# EAGLE design platform_driver_all2 (EAGLE 6.5.0)
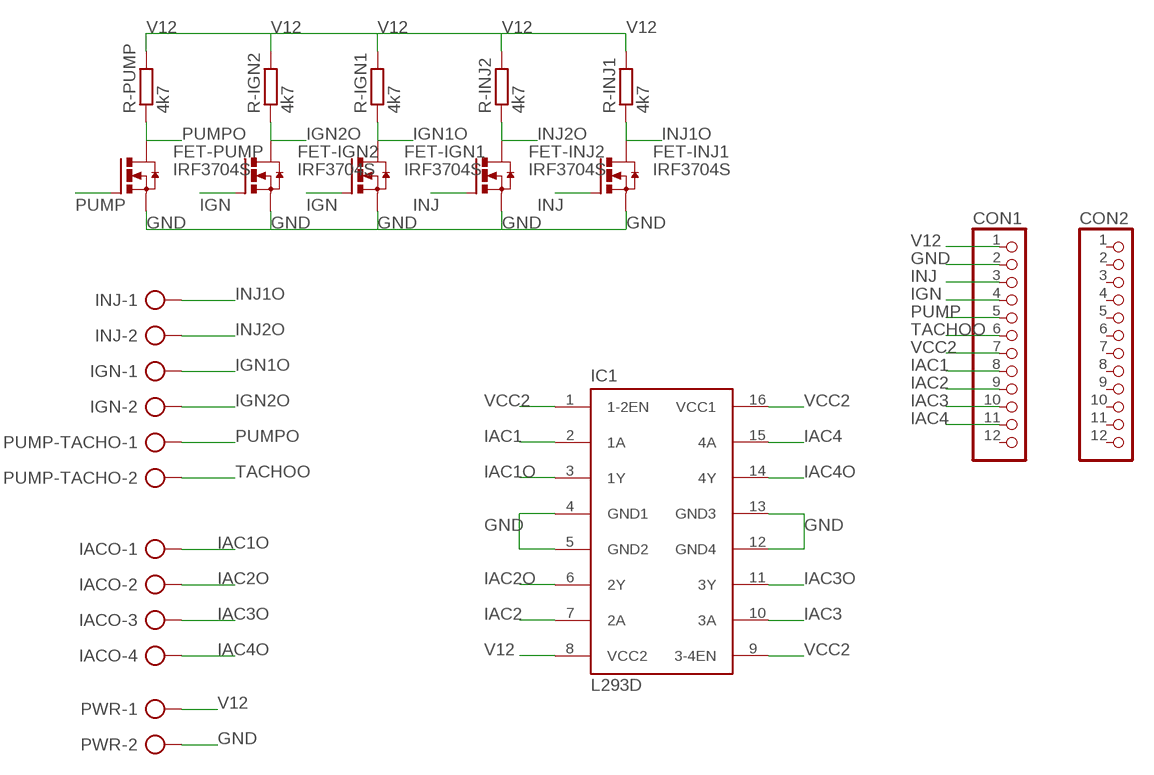
[diagram p0: schematic, sheet 1]

## Parts
CON1  PINHD-1X12  [1X12]
CON2  PINHD-1X12  [1X12]
FET-IGN1  IRF3704S  [D2PACK]
FET-IGN2  IRF3704S  [D2PACK]
FET-INJ1  IRF3704S  [D2PACK]
FET-INJ2  IRF3704S  [D2PACK]
FET-PUMP  IRF3704S  [D2PACK]
IACO  AK300/4  [AK300/4]
IC1  L293D  [DIL16]
IGN  AK300/2  [AK300/2]
INJ  AK300/2  [AK300/2]
PUMP-TACHO  AK300/2  [AK300/2]
PWR  AK300/2  [AK300/2]
R-IGN1  4k7  R-EU_M1206  [M1206]
R-IGN2  4k7  R-EU_M1206  [M1206]
R-INJ1  4k7  R-EU_M1206  [M1206]
R-INJ2  4k7  R-EU_M1206  [M1206]
R-PUMP  4k7  R-EU_M1206  [M1206]

## Nets
GND: CON1.2 FET-IGN1.3(S) FET-IGN2.3(S) FET-INJ1.3(S) FET-INJ2.3(S) FET-PUMP.3(S) IC1.4(GND1) IC1.5(GND2) IC1.12(GND4) IC1.13(GND3) PWR.2
IAC1: CON1.8 IC1.2(1A)
IAC1O: IACO.1 IC1.3(1Y)
IAC2: CON1.9 IC1.7(2A)
IAC2O: IACO.2 IC1.6(2Y)
IAC3: CON1.10 IC1.10(3A)
IAC3O: IACO.3 IC1.11(3Y)
IAC4: CON1.11 IC1.15(4A)
IAC4O: IACO.4 IC1.14(4Y)
IGN: CON1.4 FET-IGN1.1(G) FET-IGN2.1(G)
IGN1O: FET-IGN1.2(D) IGN.1 R-IGN1.1
IGN2O: FET-IGN2.2(D) IGN.2 R-IGN2.1
INJ: CON1.3 FET-INJ1.1(G) FET-INJ2.1(G)
INJ1O: FET-INJ1.2(D) INJ.1 R-INJ1.1
INJ2O: FET-INJ2.2(D) INJ.2 R-INJ2.1
PUMP: CON1.5 FET-PUMP.1(G)
PUMPO: FET-PUMP.2(D) PUMP-TACHO.1 R-PUMP.1
TACHOO: CON1.6 PUMP-TACHO.2
V12: CON1.1 IC1.8(VCC2) PWR.1 R-IGN1.2 R-IGN2.2 R-INJ1.2 R-INJ2.2 R-PUMP.2
VCC2: CON1.7 IC1.1(1-2EN) IC1.9(3-4EN) IC1.16(VCC1)
Unconnected: CON1.12 CON2.1 CON2.2 CON2.3 CON2.4 CON2.5 CON2.6 CON2.7 CON2.8 CON2.9 CON2.10 CON2.11 CON2.12

## Library data of the parts
CON1 CON2 = pinhead:PINHD-1X12: PIN HEADER
FET-IGN1 FET-IGN2 FET-INJ1 FET-INJ2 FET-PUMP = transistor-power:IRF3704: SMPS MOSFET HEXFET® Power MOSFET Source: http://www.irf.com/product-info/datasheets/data/irf3704.pdf
IACO = con-ptr500:AK300/4: CONNECTOR; OC_FARNELL: unknown; OC_NEWARK: unknown
IC1 = st-microelectronics:L293D: PUSH-PULL 4 CHANNEL DRIVER; MPN: L293D; OC_FARNELL: 9589619; OC_NEWARK: 56P8249
IGN INJ PUMP-TACHO PWR = con-ptr500:AK300/2: CONNECTOR; OC_FARNELL: unknown; OC_NEWARK: unknown
R-IGN1 R-IGN2 R-INJ1 R-INJ2 R-PUMP = resistor:R-EU_: RESISTOR, European symbol

## Board
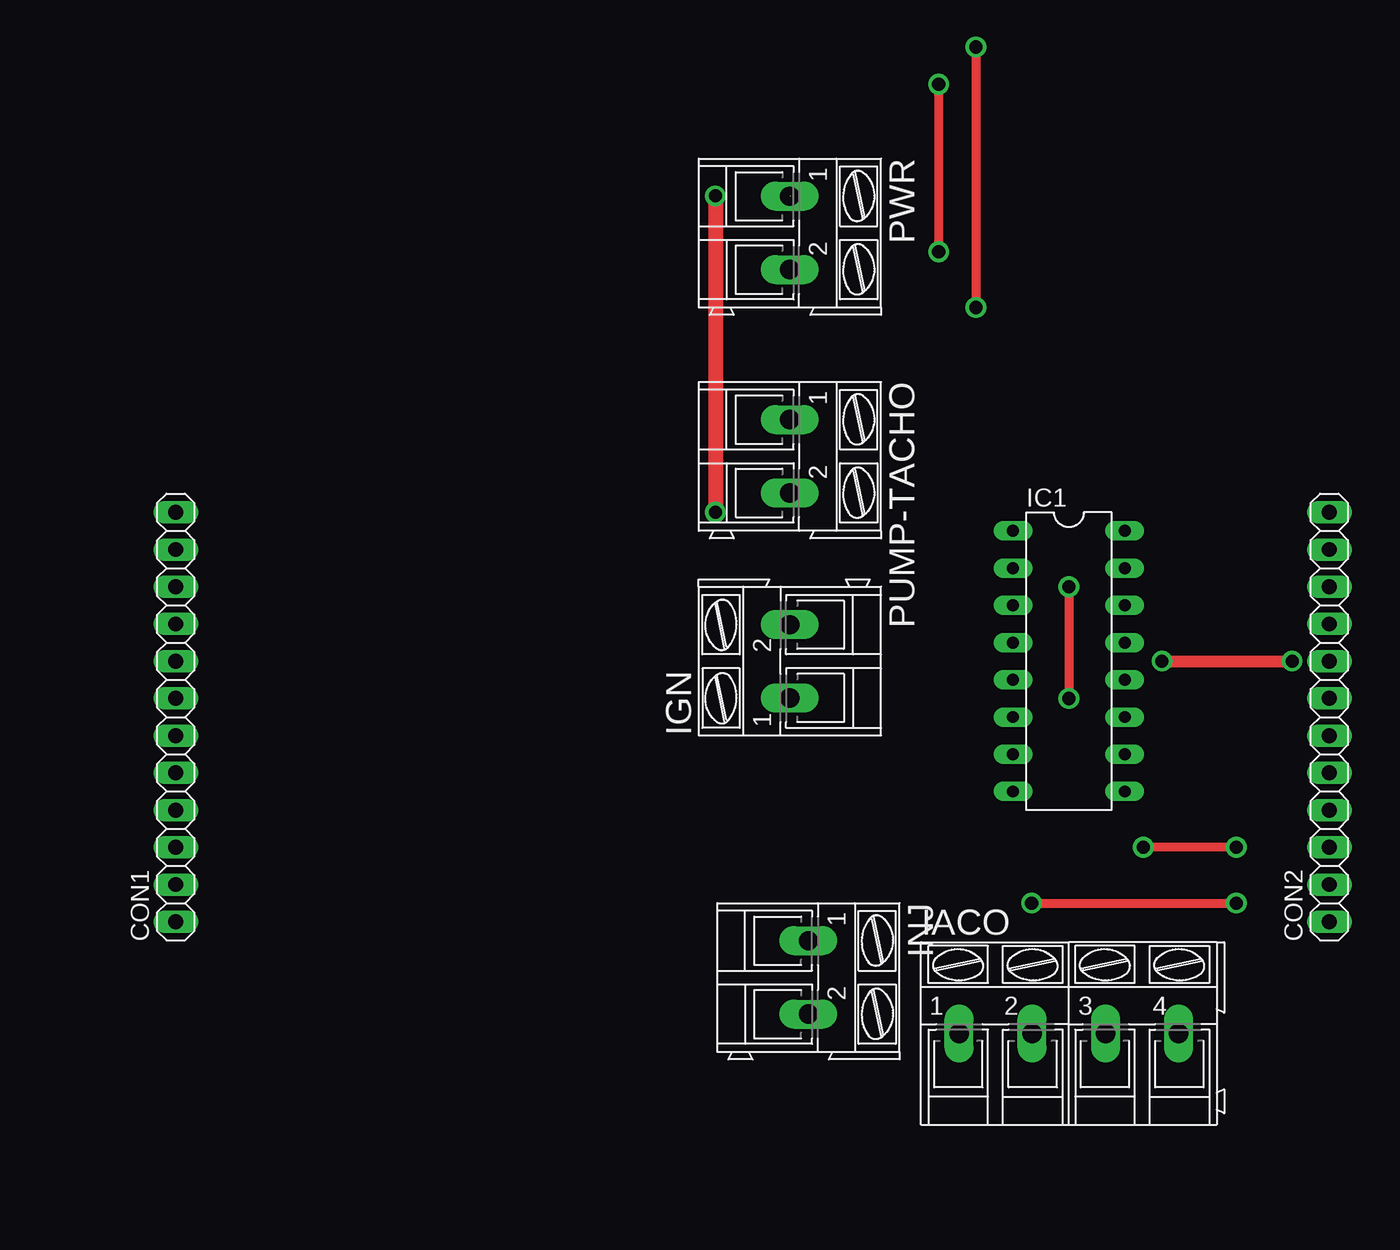
[diagram p1: board, top side]
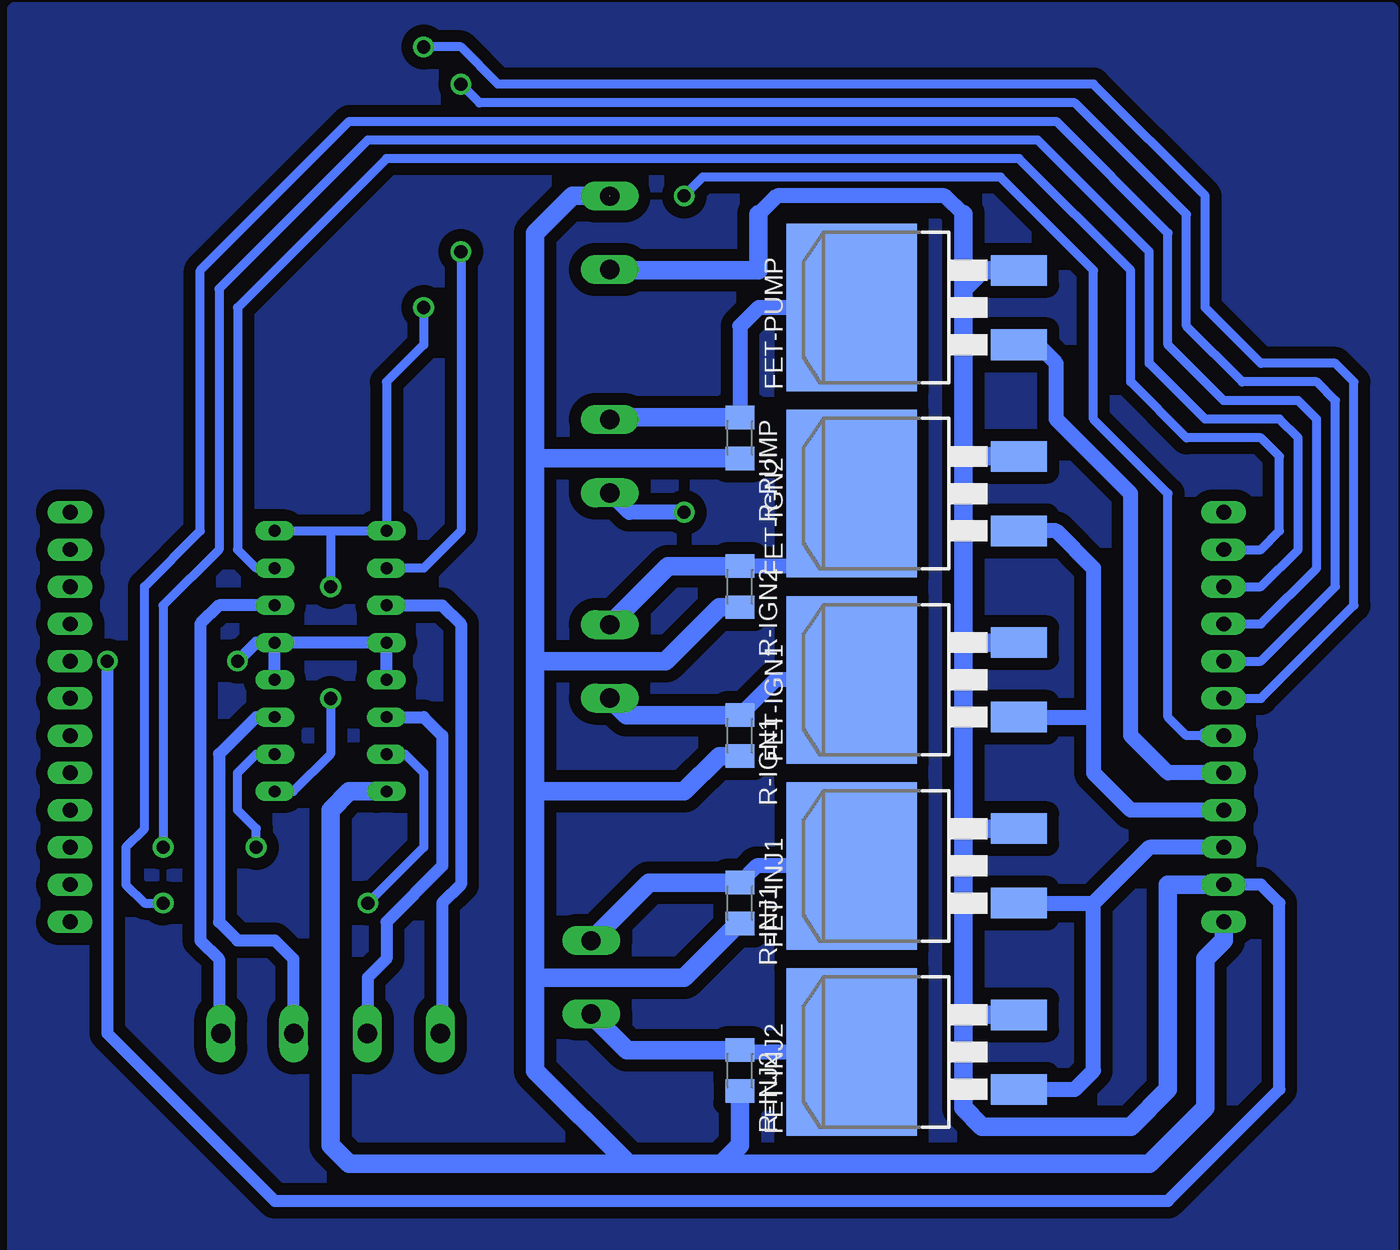
[diagram p2: board, bottom side, seen from below]

No outline drawn. Coordinates in mm, seen from the top.
Copper layers (1*16): Top 0.035mm / dielectric 1.5mm / Bottom 0.035mm
Design rules "default *": minimum track width 10mil, minimum drill 24mil, track to track 8mil, track to pad 8mil, pad to pad 8mil, via to via 8mil, smd to smd 8mil, copper to edge 40mil, drill to drill 8mil, minimum pad ring 10mil, minimum via ring 10mil, stop-mask expansion 4mil, vias tented up to drill 0mil, thermal gap 10mil

### Footprints (pad centres in the part's own frame; a part is rotated, then mirrored left to right if it is on the bottom)
1X12 = drill 1.016 long: 1 -13.97,0; 2 -11.43,0; 3 -8.89,0; 4 -6.35,0; 5 -3.81,0; 6 -1.27,0; 7 1.27,0; 8 3.81,0; 9 6.35,0; 10 8.89,0; 11 11.43,0; 12 13.97,0
D2PACK = smd 2.083 x 3.81: 1 -2.54,-8.89; 3 2.54,-8.89 | smd 11.43 x 8.89: 2 0,2.54
AK300/4 = drill 1.321 long: 1 -7.493,0; 2 -2.515,0; 3 2.515,0; 4 7.493,0
DIL16 = drill 0.813 long: 1 -8.89,-3.81; 2 -6.35,-3.81; 3 -3.81,-3.81; 4 -1.27,-3.81; 5 1.27,-3.81; 6 3.81,-3.81; 7 6.35,-3.81; 8 8.89,-3.81; 9 8.89,3.81; 10 6.35,3.81; 11 3.81,3.81; 12 1.27,3.81; 13 -1.27,3.81; 14 -3.81,3.81; 15 -6.35,3.81; 16 -8.89,3.81
AK300/2 = drill 1.321 long: 1 -2.515,0; 2 2.489,0
M1206 = smd 1.6 x 2: 1 -1.4,0; 2 1.4,0

### Placement (x,y rotation side)
CON1  8.89,34.29 90 top
CON2  87.63,34.29 90 top
FET-IGN1  31.75,36.83 90 bottom
FET-IGN2  31.75,49.53 90 bottom
FET-INJ1  31.75,24.13 90 bottom
FET-INJ2  31.75,11.43 90 bottom
FET-PUMP  31.75,62.23 90 bottom
IACO  69.85,12.7 0 top
IC1  69.85,38.1 270 top
IGN  50.8,38.1 90 top
INJ  52.07,16.51 270 top
PUMP-TACHO  50.8,52.07 270 top
PWR  50.8,67.31 270 top
R-IGN1  41.91,33.02 270 bottom
R-IGN2  41.91,43.18 270 bottom
R-INJ1  41.91,21.59 270 bottom
R-INJ2  41.91,10.16 270 bottom
R-PUMP  41.91,53.34 270 bottom

### Tracks (layer width: path | path; a pad name or v marks a point on that pad's centre or on a via)
GND  (via drill 0.9)
  Top 0.813: v76.2,38.1 v85.09,38.1
  Bottom 0.813: IC1.4 IC1.13 IC1.12 | IC1.5 IC1.4 | IC1.4 74.93,39.37 v76.2,38.1 | v85.09,38.1 85.09,12.7 73.66,1.27 12.7,1.27 5.08,8.89 5.08,21.59 6.35,22.86 CON1.2
  Bottom 1.016: 26.67,68.58 27.94,69.85 39.37,69.85 40.64,68.58
  Bottom 1.27: CON1.2 12.7,22.86 12.7,8.89 15.24,6.35 25.4,6.35 26.67,7.62 26.67,13.97 | 26.67,13.97 26.67,26.67 | 26.67,26.67 26.67,39.37 | 26.67,39.37 26.67,52.07 | 26.67,52.07 26.67,63.5 | 26.67,63.5 25.4,64.77 FET-PUMP.3 | FET-IGN2.3 26.67,52.07 | FET-IGN1.3 26.67,39.37 | FET-INJ1.3 26.67,26.67 | FET-INJ2.3 26.67,13.97 | 26.67,63.5 26.67,68.58 | 40.64,68.58 40.64,64.77 50.75,64.77 PWR.2
IAC1  (via drill 0.9)
  Top 0.61: v60.96,77.47 v60.96,66.04
  Bottom 0.61: CON1.8 6.35,38.1 1.27,43.18 1.27,55.88 2.54,57.15 7.62,57.15 11.43,60.96 11.43,68.58 19.05,76.2 59.69,76.2 v60.96,77.47 | v60.96,66.04 60.96,46.99 63.5,44.45 IC1.2
IAC1O
  Bottom 0.813: IC1.3 62.23,41.91 60.96,40.64 60.96,22.86 62.23,21.59 62.23,12.83 IACO.1
IAC2  (via drill 0.9)
  Top 0.61: v67.31,21.59 v81.28,21.59
  Bottom 0.61: CON1.9 6.35,40.64 2.54,44.45 2.54,54.61 3.81,55.88 8.89,55.88 12.7,59.69 12.7,67.31 20.32,74.93 68.58,74.93 78.74,64.77 78.74,46.99 82.55,43.18 82.55,26.67 83.82,25.4 83.82,22.86 82.55,21.59 v81.28,21.59 | IC1.7 64.77,31.75 63.5,30.48 63.5,25.4 v67.31,21.59
IAC2O
  Bottom 0.813: IC1.6 63.5,34.29 62.23,33.02 62.23,24.13 66.04,20.32 66.04,17.78 67.31,16.51 67.31,12.72 IACO.2
IAC3  (via drill 0.9)
  Top 0.61: v81.28,25.4 v74.93,25.4
  Bottom 0.61: CON1.10 6.35,43.18 3.81,45.72 3.81,53.34 5.08,54.61 10.16,54.61 13.97,58.42 13.97,66.04 21.59,73.66 67.31,73.66 77.47,63.5 77.47,45.72 81.28,41.91 v81.28,25.4 | v74.93,25.4 74.93,26.67 76.2,27.94 76.2,30.48 74.93,31.75 IC1.10
IAC3O
  Bottom 0.813: IC1.11 74.93,34.29 77.47,31.75 77.47,20.32 76.2,19.05 73.66,19.05 72.39,17.78 72.39,12.72 IACO.3
IAC4
  Bottom 0.61: CON1.11 6.35,45.72 5.08,46.99 5.08,52.07 6.35,53.34 11.43,53.34 15.24,57.15 15.24,64.77 22.86,72.39 66.04,72.39 76.2,62.23 76.2,45.72 74.93,44.45 IC1.15
IAC4O
  Bottom 0.813: IC1.14 77.47,41.91 78.74,40.64 78.74,19.05 77.47,17.78 77.47,12.83 IACO.4
IGN
  Bottom 1.016: CON1.4 15.24,27.94 17.78,30.48 17.78,34.29 | 17.78,34.29 17.78,44.45 20.32,46.99 FET-IGN2.1 | FET-IGN1.1 17.78,34.29
IGN1O
  Bottom 1.016: FET-IGN1.2 39.5,36.83 R-IGN1.1
  Bottom 1.27: 41.78,34.29 R-IGN1.1 49.63,34.42 IGN.1
IGN2O
  Bottom 1.016: 33.15,44.58 R-IGN2.1
  Bottom 1.27: 33.15,44.58 FET-IGN2.2 | R-IGN2.1 46.81,44.58 IGN.2
INJ
  Bottom 1.016: CON1.3 13.97,25.4 17.78,21.59 | 17.78,21.59 17.78,10.16 19.05,8.89 FET-INJ2.1 | FET-INJ1.1 17.78,21.59
INJ1O
  Bottom 1.016: FET-INJ1.2 40.77,24.13 R-INJ1.1
  Bottom 1.27: 41.78,22.86 R-INJ1.1 48.1,22.99 INJ.1
INJ2O
  Bottom 1.016: FET-INJ2.2 41.91,11.43 R-INJ2.1
  Bottom 1.27: 41.78,11.43 R-INJ2.1 49.61,11.56 INJ.2
N$1
  pour Bottom (isolate 0.813): -2.54,82.55 91.44,82.55 91.44,-2.54 -2.54,-2.54
PUMP
  Bottom 1.016: CON1.5 12.7,30.48 15.24,33.02 15.24,49.53 20.32,54.61 20.32,58.42 21.59,59.69 FET-PUMP.1
PUMPO
  Bottom 1.016: FET-PUMP.2 40.64,62.23 41.91,60.96 R-PUMP.1
  Bottom 1.27: 41.78,54.61 R-PUMP.1 50.65,54.74 PUMP-TACHO.1
TACHOO  (via drill 0.9)
  Top 1.016: v45.72,69.85 v45.72,48.26
  Bottom 0.61: 10.16,33.02 11.43,33.02 12.7,34.29 12.7,49.53 17.78,54.61 17.78,64.77 24.13,71.12 44.45,71.12 v45.72,69.85
  Bottom 1.016: CON1.6 10.16,33.02 | v45.72,48.26 49.48,48.26 PUMP-TACHO.2
V12  (1 unrouted)
  Bottom 1.27: CON1.1 8.89,19.05 10.16,17.78 10.16,7.62 13.97,3.81 43.18,3.81 | 43.18,3.81 48.26,3.81 49.53,3.81 | 49.53,3.81 55.88,10.16 55.88,16.51 | 55.88,16.51 55.88,29.21 | 55.88,29.21 55.88,38.1 | 55.88,38.1 55.88,52.07 | 55.88,52.07 55.88,67.31 53.34,69.85 50.8,69.85 | R-PUMP.2 55.75,51.94 55.88,52.07 | R-IGN2.2 43.31,41.78 46.99,38.1 55.88,38.1 | R-IGN1.2 43.31,31.62 45.72,29.21 55.88,29.21 | R-INJ1.2 42.04,20.19 45.72,16.51 55.88,16.51 | R-INJ2.2 41.91,5.08 43.18,3.81 | IC1.8 68.58,29.21 69.85,27.94 69.85,5.08 68.58,3.81 49.53,3.81
VCC2  (via drill 0.9)
  Top 0.61: v69.85,43.18 v69.85,35.56 | v63.5,80.01 v63.5,62.23
  Bottom 0.61: IC1.16 69.85,46.99 | 69.85,46.99 IC1.1 66.04,57.15 63.5,59.69 v63.5,62.23 | IC1.9 72.39,29.21 69.85,31.75 v69.85,35.56 | 69.85,46.99 v69.85,43.18 | CON1.7 6.35,35.56 0,41.91 0,57.15 1.27,58.42 6.35,58.42 10.16,62.23 10.16,69.85 17.78,77.47 58.42,77.47 60.96,80.01 v63.5,80.01